# Altium project Carte_Micro_PIC18F.PrjPcb
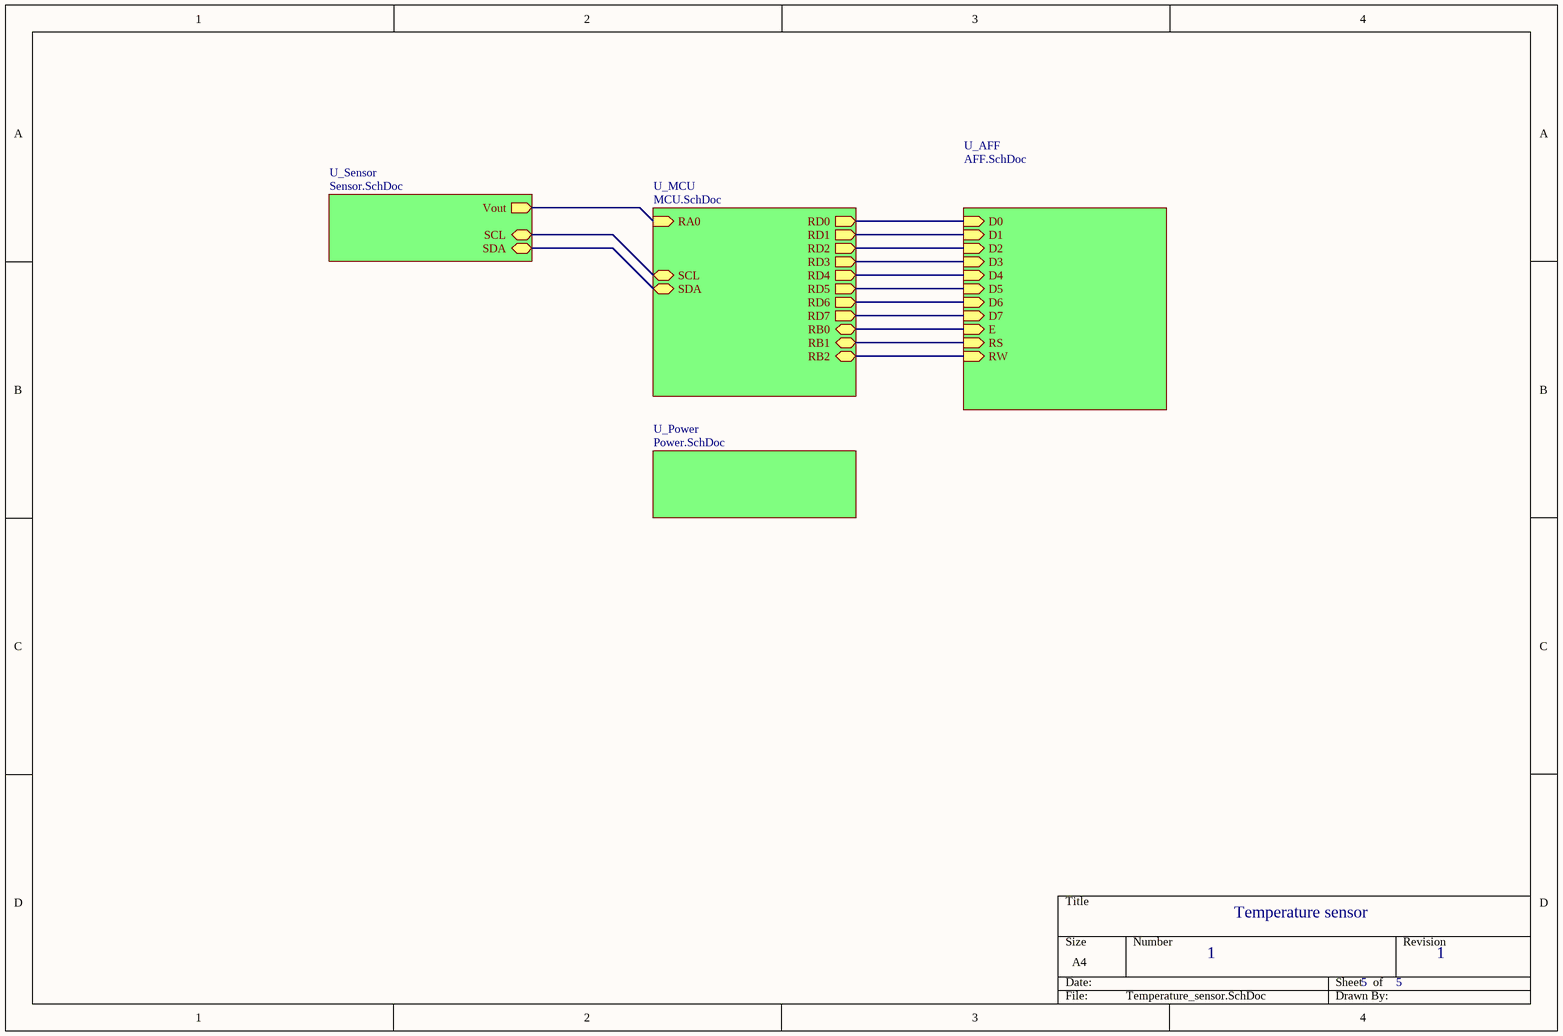
[diagram p0: Temperature_sensor.SchDoc]
5 sheets, 22 parts. Net scope: hierarchical (ports join the sheet entries above them; power ports are global).
Board file: Carte_Micro_PIC18F.PcbDoc
Sheets:
  Temperature_sensor.SchDoc
    U_Power = Power.SchDoc
    U_Sensor = Sensor.SchDoc
    U_MCU = MCU.SchDoc
    U_AFF = AFF.SchDoc

## Sheet Temperature_sensor.SchDoc: Temperature_sensor
size A4; DocumentNumber: 1; Revision: 1; SheetNumber: 1; SheetTotal: 5

### Sub-sheets
U_AFF = AFF.SchDoc: RS (in), RW (in), E (in), D0 (in), D1 (in), D2 (in), D3 (in), D4 (in), D5 (in), D6 (in), D7 (in)
U_MCU = MCU.SchDoc: RA0 (in), RB0 (bidir), RB1 (bidir), RB2 (bidir), SCL (bidir), SDA (bidir), RD0 (out), RD1 (out), RD2 (out), RD3 (out), RD4 (out), RD5 (out), RD6 (out), RD7 (out)
U_Power = Power.SchDoc: no entries
U_Sensor = Sensor.SchDoc: Vout (out), SDA (bidir), SCL (bidir)

### Nets
RA0: sheet U_Sensor/Vout, sheet U_MCU/RA0
RB0: sheet U_MCU/RB0, sheet U_AFF/E
RB1: sheet U_MCU/RB1, sheet U_AFF/RS
RB2: sheet U_MCU/RB2, sheet U_AFF/RW
RD0: sheet U_MCU/RD0, sheet U_AFF/D0
RD1: sheet U_MCU/RD1, sheet U_AFF/D1
RD2: sheet U_MCU/RD2, sheet U_AFF/D2
RD3: sheet U_MCU/RD3, sheet U_AFF/D3
RD4: sheet U_MCU/RD4, sheet U_AFF/D4
RD5: sheet U_MCU/RD5, sheet U_AFF/D5
RD6: sheet U_MCU/RD6, sheet U_AFF/D6
RD7: sheet U_MCU/RD7, sheet U_AFF/D7
SCL: sheet U_Sensor/SCL, sheet U_MCU/SCL
SDA: sheet U_Sensor/SDA, sheet U_MCU/SDA

### Notes on the sheet
- Temperature sensor
- 1
- 5

## Sheet Power.SchDoc: Power
size A4; DocumentNumber: 2; Revision: 1; SheetNumber: 4; SheetTotal: 5; SPICEModelCacheMWSFBRXI: <root> / <DocumentId>MWSFBRXI</DocumentId> / <CacheFrame Number="0"> / <Model Name="1n4001" Kind="MDL"> / <Text>*1N4001 MCE 8-16-95 / *50V 1A Si GenPurpose Diode pkg:DIODE0.4 1,2 / .MODEL 1N4001 D(IS=2.55E-9 RS=0.042 N=1.75 TT=5.76E-6 CJO=1.85E-11 / + VJ=0.75 M=0.333 BV=50 IBV=1E-5 )</Text> / </Model> / <Model Name="led0" Kind="MDL"> / <Text>*Typ INFRARED GaAs LED: Vf=1.2V Vr=5V If=40mA trr=3uS / *LED Pinout: 1=A, 2=K / .MODEL LED0 D (IS=93.5P RS=84M N=2.63 BV=5 IBV=10U / + CJO=2.97P VJ=.75 M=.333 TT=4.32U)</Text> / </Model> / <Model Name="cap" Kind="MDL"> / <Text>*Default semiconductor capacitor / .MODEL CAP C()</Text> / </Model> / </CacheFrame> / </root>
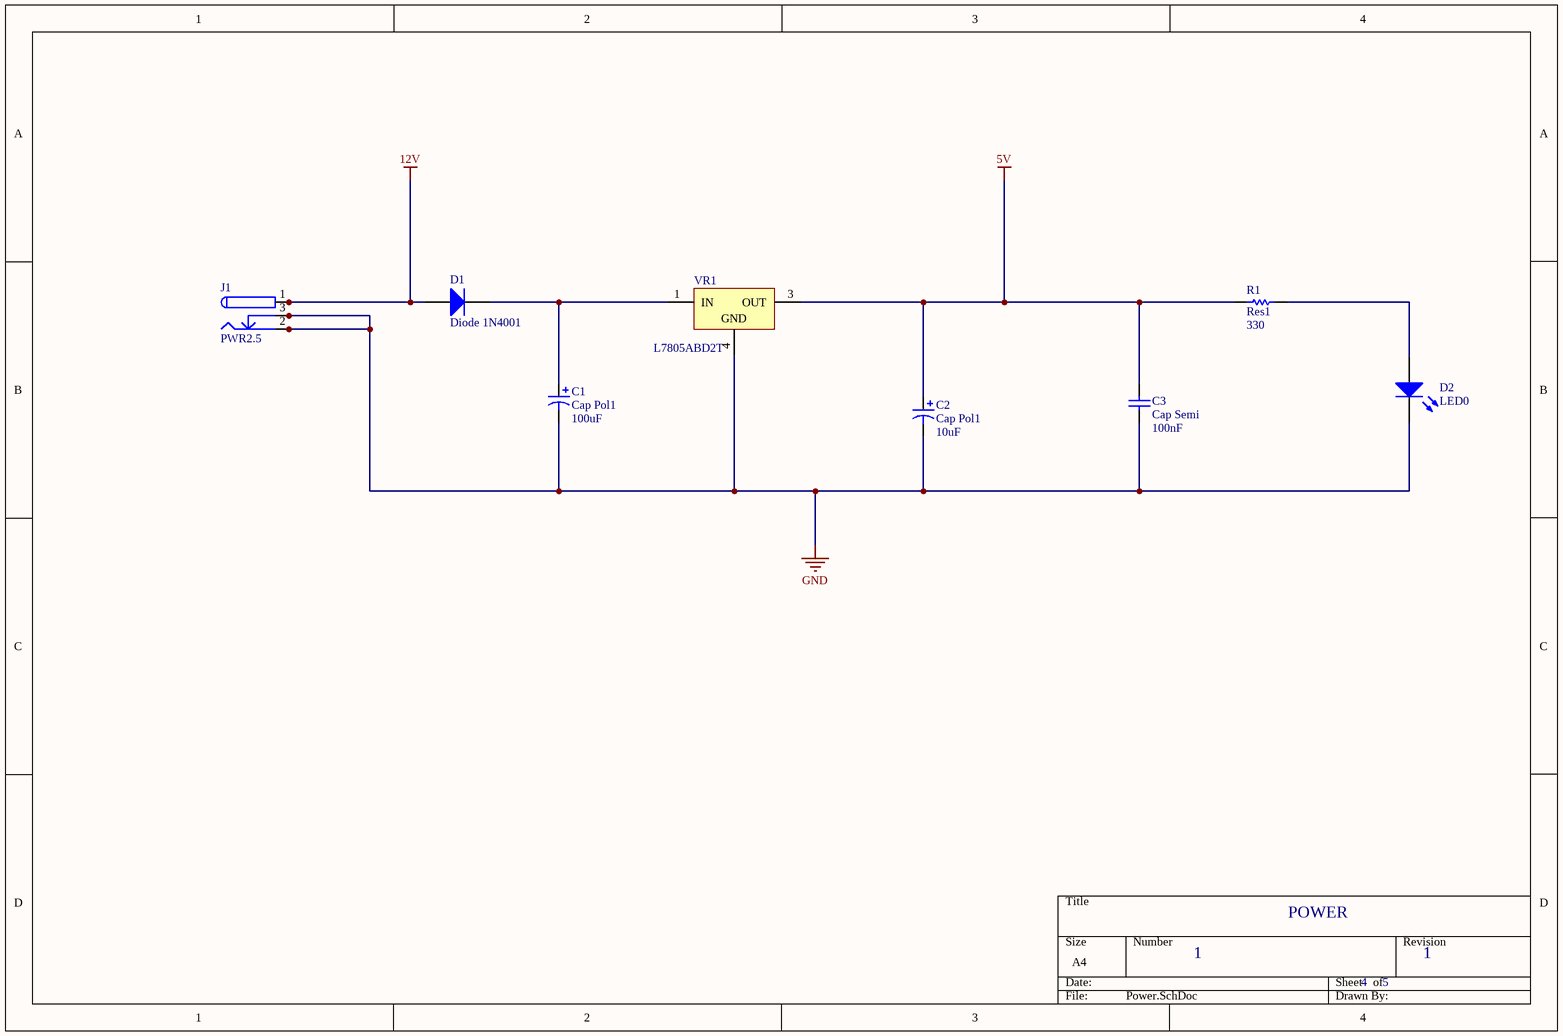
[diagram p1: Power.SchDoc]

### Parts
C1  Cap Pol1  value 100uF  [RB7.6-15]
C2  Cap Pol1  value 10uF  [RB7.6-15]
C3  Cap Semi  value 100nF  [C1206]
D1  Diode 1N4001  [DO-41]
D2  LED0  [LED-0]
J1  PWR2.5  [KLD-0202]
R1  Res1  value 330  [0805]
VR1  L7805ABD2T  [TO-263]

### Nets
5V: C2.1 C3.2 R1.1 VR1.3(OUT)
12V: D1.1(A) J1.1 J1.1A J1.1B
GND: C1.2 C2.2 C3.1 D2.2(K) J1.2 J1.2A J1.2B J1.3 J1.3A J1.3B VR1.4(GND)
NetC1_1: C1.1 D1.2(K) VR1.1(IN)
NetD2_1: D2.1(A) R1.2

### Notes on the sheet
- POWER
- 1
- 4
- 5

### Library data of the parts
C1 C2 = Cap Pol1: Polarized Capacitor (Radial); Published: 8-Jun-2000; LatestRevisionDate: 17-Jul-2002; LatestRevisionNote: Re-released for DXP Platform.; PackageReference: RB7.6-15; Publisher: Altium Limited; PackageDescription: Polarized Capacitor (Radial); 2 Leads
C3 = Cap Semi: Capacitor (Semiconductor SIM Model); Published: 8-Jun-2000; LatestRevisionDate: 29-May-2009; LatestRevisionNote: IPC-7351 Footprint Added.; PackageReference: C1206; Publisher: Altium Limited; PackageDescription: Chip Capacitor
D1 = Diode 1N4001: 1 Amp General Purpose Rectifier; Published: 8-Jun-2000; LatestRevisionDate: 17-Jul-2002; LatestRevisionNote: Re-released for DXP Platform.; DatasheetVersion: 1998; PackageVersion: Aug-1999; PackageReference: DO-41; Publisher: Altium Limited; PackageDescription: Diode, Axial; Body 5.2 x 2.7 mm (LxDia. max), Lead Dia. 0.86 mm (max); Code_JEDEC: DO-204-AL; ComponentLink1Description: Manufacturer Link; ComponentLink1URL: http://www.fairchildsemi.com/; ComponentLink2Description: Datasheet; ComponentLink2URL: http://www.fairchildsemi.com/ds/1N%2F1N4001.pdf
D2 = LED0: Typical INFRARED GaAs LED; Published: 8-Jun-2000; LatestRevisionDate: 08-Jul-2005; LatestRevisionNote: Mech Layer 1 removed.; PackageReference: LED-0; Publisher: Altium Limited; PackageDescription: LED; 2 Leads
J1 = PWR2.5: Low Voltage Power Supply Connector; Published: 17-Dec-2003; DatasheetDocument: 09-May-2002; Publisher: Altium Limited; ComponentLink1Description: Manufacturer Link; ComponentLink1URL: http://domino.kycon.com/internet/Products.html
R1 = Res1: Resistor; Published: 8-Jun-2000; LatestRevisionDate: 17-Jul-2002; LatestRevisionNote: Re-released for DXP Platform.; PackageReference: AXIAL-0.3; Publisher: Altium Limited; PackageDescription: Axial Device, Thru-Hole; 2 Leads; 0.3 in Pin Spacing
VR1 = L7805ABD2T: Precision 1A Regulator; Published: 24-Aug-2001; LatestRevisionDate: 17-Jul-2002; LatestRevisionNote: Re-released for DXP Platform.; DatasheetVersion: Nov-1999; PackageReference: TO-263; Publisher: Altium Limited; PackageDescription: D2-PAK/TO-263-AB; 3 Leads (1 Cropped); Body 15.9 (inc. leads) x 10.4 mm (LxW max); ComponentLink1Description: Manufacturer Link; ComponentLink1URL: http://www.st.com/; ComponentLink2Description: Datasheet; ComponentLink2URL: http://www.st.com/stonline/products/literature/ds/2144/l7805ab.pdf

## Sheet Sensor.SchDoc: Sensor
size A4; DocumentNumber: 1; Revision: 1; SheetNumber: 3; SheetTotal: 5
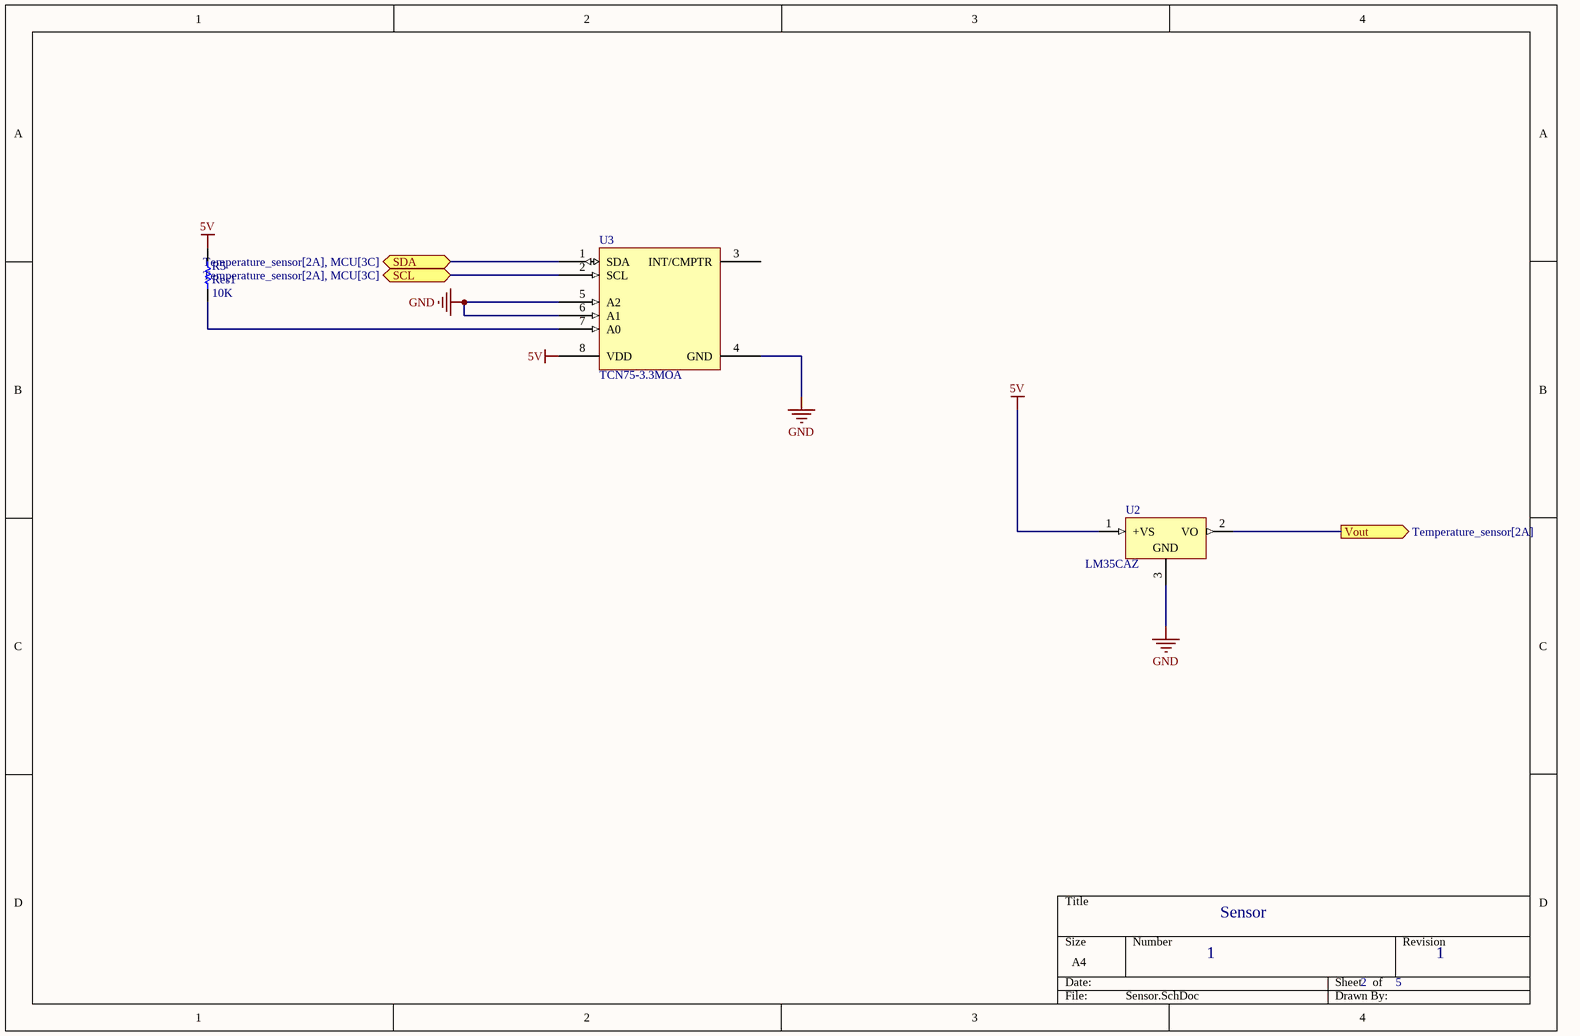
[diagram p2: Sensor.SchDoc]

### Parts
R5  Res1  value 10K  [0805]
U2  LM35CAZ  [Z03A]
U3  TCN75-3.3MOA  [SOIC127P600X175-8N]

### Ports
SCL (bidir, see Temperature_sensor[2A], MCU[3C]), SDA (bidir, see Temperature_sensor[2A], MCU[3C]), Vout (out, see Temperature_sensor[2A])

### Nets
5V: R5.2 U2.1(+VS) U3.8(VDD)
GND: U2.3(GND) U3.4(GND) U3.5(A2) U3.6(A1)
RA0: U2.2(VO) ; port Vout
SCL: U3.2(SCL) ; port SCL
SDA: U3.1(SDA) ; port SDA
NetR5_1: R5.1 U3.7(A0)

Not connected (* = marked no-connect by the designer): U3 3(INT/CMPTR)

### Notes on the sheet
- Sensor
- 1
- 2
- 5

### Library data of the parts
R5 = Res1: Resistor; Published: 8-Jun-2000; LatestRevisionDate: 17-Jul-2002; LatestRevisionNote: Re-released for DXP Platform.; PackageReference: AXIAL-0.3; Publisher: Altium Limited; PackageDescription: Axial Device, Thru-Hole; 2 Leads; 0.3 in Pin Spacing
U2 = LM35CAZ: Precision Centigrade Temperature Sensor, 3-pin TO-92; Manufacturer: National Semiconductor; PackageTopMarking: NSXYTT*LM35*CAZ; PowerWise: N; CompType: Temp Sensor IC; Published: 4-Dec-2008; LatestRevisionDate: 15-Jul-2009; LatestRevisionNote: Sch pins 1 & 3 reversed.; DatasheetVersion: Nov-2000; PackageVersion: revG, Sep-2000; PackageReference: Z03A; Publisher: Altium Limited; PackageDescription: TO-92, Molded, 3 Lead; Supplier 1: Farnell; Supplier Part Number 1: 9494529; PartNumber: LM35CAZ; RoHS: N; PinCount: 3; Code_JEDEC: TO-226-AA; ComponentLink1Description: LM35 Datasheet; ComponentLink1URL: http://www.national.com/ds/LM/LM35.pdf; ComponentLink2Description: LM35 Web Page; ComponentLink2URL: http://www.national.com/pf/LM/LM35.html; ComponentLink3Description: Z03A Package Page; ComponentLink3URL: http://www.national.com/packaging/folders/z03a.html
U3 = TCN75

## Sheet MCU.SchDoc: MCU
size A4; DocumentNumber: 1; Revision: 1; SheetNumber: 2; SheetTotal: 5; SPICEModelCacheJNIDMDJG: <root> / <DocumentId>JNIDMDJG</DocumentId> / <CacheFrame Number="0"> / <Model Name="xtal" Kind="CKT"> / <Text>*Generic type:crystal pkg:HC33/51 / .SUBCKT XTAL 1 2 PARAMS: FREQ=1Meg RS=750 C=13pf Q=1000 / LX 1 3 {((Q*RS)/(6.2831852*FREQ))} IC=0.5M / CX 3 4 {(1/(Q*6.2831852*FREQ*RS))} / C0 1 2 {C} / RS 4 2 {RS} / .ENDS XTAL</Text> / </Model> / <Model Name="cap" Kind="MDL"> / <Text>*Default semiconductor capacitor / .MODEL CAP C()</Text> / </Model> / </CacheFrame> / </root>
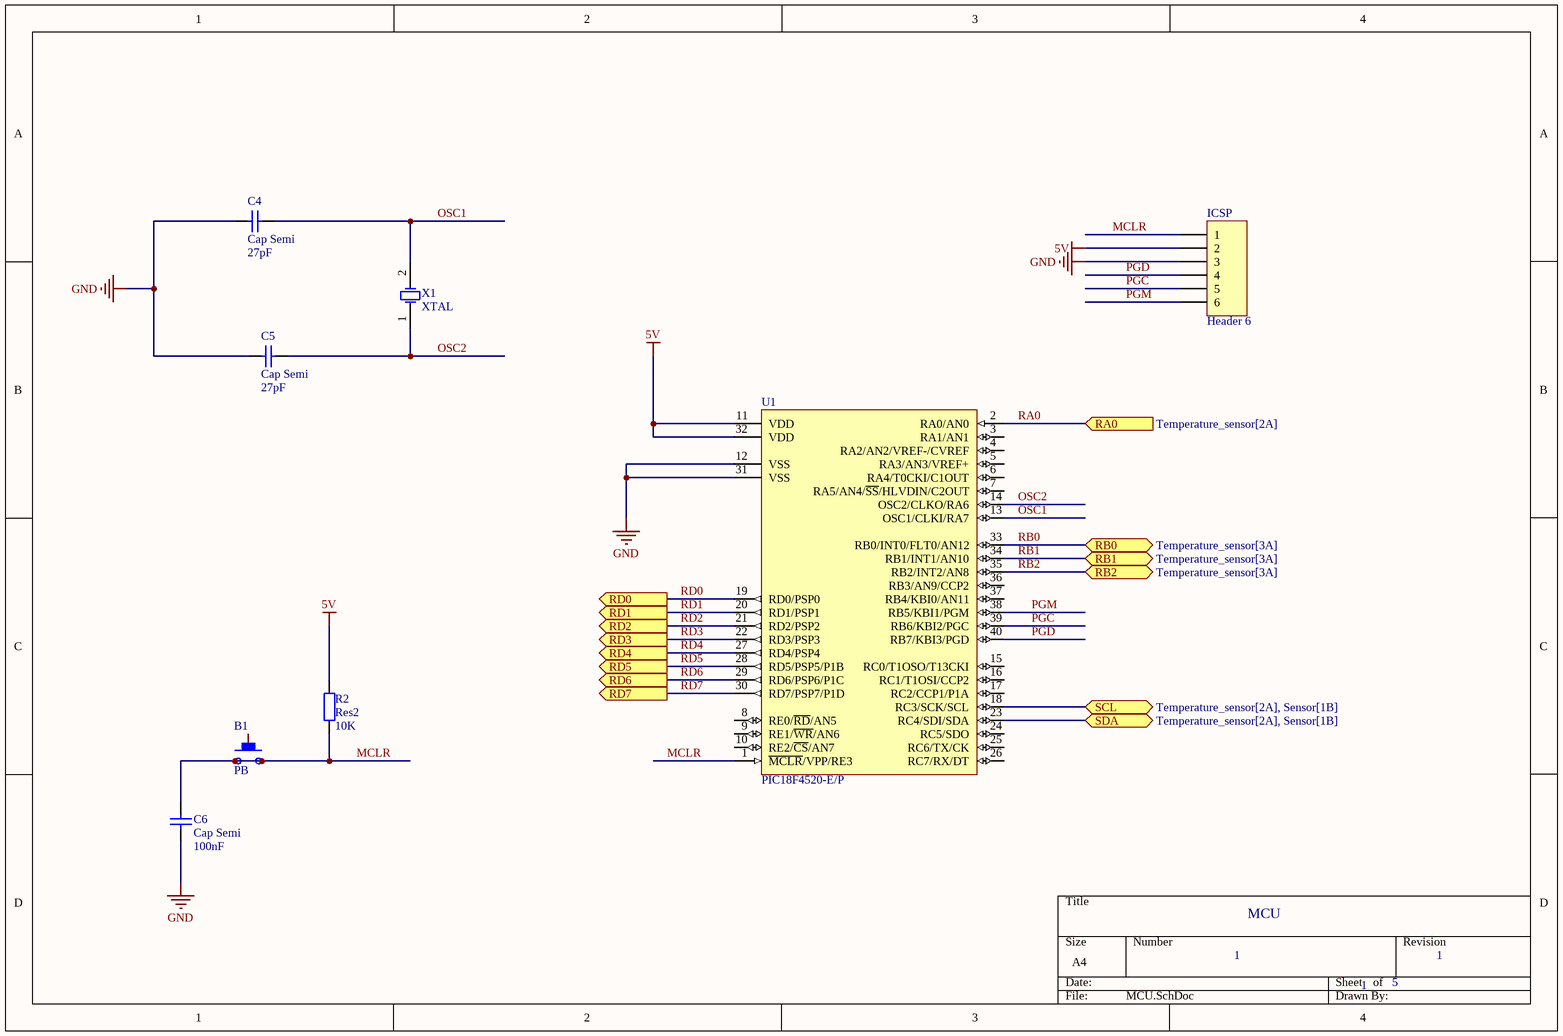
[diagram p3: MCU.SchDoc]

### Parts
B1  PB  [Push button]
C4  Cap Semi  value 27pF  [C1206]
C5  Cap Semi  value 27pF  [C1206]
C6  Cap Semi  value 100nF  [C1206]
ICSP  Header 6  [HDR1X6]
R2  Res2  value 10K  [0805]
U1  PIC18F4520-E/P  [PDIP600-P40]
X1  XTAL  [R38]

### Ports
RA0 (in, see Temperature_sensor[2A]), RB0 (bidir, see Temperature_sensor[3A]), RB1 (bidir, see Temperature_sensor[3A]), RB2 (bidir, see Temperature_sensor[3A]), RD0 (out), RD1 (out), RD2 (out), RD3 (out), RD4 (out), RD5 (out), RD6 (out), RD7 (out), SCL (bidir, see Temperature_sensor[2A], Sensor[1B]), SDA (bidir, see Temperature_sensor[2A], Sensor[1B])

### Nets
5V: ICSP.2 R2.2 U1.11(VDD) U1.32(VDD)
GND: C4.1 C5.1 C6.2 ICSP.3 U1.12(VSS) U1.31(VSS)
MCLR: B1.0 B1.1 C6.1 ICSP.1 R2.1 U1.1(~{MCLR}/VPP/RE3)
OSC1: C4.2 U1.13(OSC1/CLKI/RA7) X1.2(OSC2)
OSC2: C5.2 U1.14(OSC2/CLKO/RA6) X1.1(OSC1)
PGC: ICSP.5 U1.39(RB6/KBI2/PGC)
PGD: ICSP.4 U1.40(RB7/KBI3/PGD)
PGM: ICSP.6 U1.38(RB5/KBI1/PGM)
RA0: U1.2(RA0/AN0) ; port RA0
RB0: U1.33(RB0/INT0/FLT0/AN12) ; port RB0
RB1: U1.34(RB1/INT1/AN10) ; port RB1
RB2: U1.35(RB2/INT2/AN8) ; port RB2
RD0: U1.19(RD0/PSP0) ; port RD0
RD1: U1.20(RD1/PSP1) ; port RD1
RD2: U1.21(RD2/PSP2) ; port RD2
RD3: U1.22(RD3/PSP3) ; port RD3
RD4: U1.27(RD4/PSP4) ; port RD4
RD5: U1.28(RD5/PSP5/P1B) ; port RD5
RD6: U1.29(RD6/PSP6/P1C) ; port RD6
RD7: U1.30(RD7/PSP7/P1D) ; port RD7
SCL: U1.18(RC3/SCK/SCL) ; port SCL
SDA: U1.23(RC4/SDI/SDA) ; port SDA

Not connected (* = marked no-connect by the designer): U1 3(RA1/AN1) 4(RA2/AN2/VREF-/CVREF) 5(RA3/AN3/VREF+) 6(RA4/T0CKI/C1OUT) 7(RA5/AN4/~{SS}/HLVDIN/C2OUT) 8(RE0/~{RD}/AN5) 9(RE1/~{WR}/AN6) 10(RE2/~{CS}/AN7) 15(RC0/T1OSO/T13CKI) 16(RC1/T1OSI/CCP2) 17(RC2/CCP1/P1A) 24(RC5/SDO) 25(RC6/TX/CK) 26(RC7/RX/DT) 36(RB3/AN9/CCP2) 37(RB4/KBI0/AN11)

### Notes on the sheet
- MCU
- 1
- 5

### Library data of the parts
C4-C6 = Cap Semi: Capacitor (Semiconductor SIM Model); Published: 8-Jun-2000; LatestRevisionDate: 29-May-2009; LatestRevisionNote: IPC-7351 Footprint Added.; PackageReference: C1206; Publisher: Altium Limited; PackageDescription: Chip Capacitor
ICSP = Header 6: Header, 6-Pin; LatestRevisionDate: 17-Jul-2002; LatestRevisionNote: Re-released for DXP Platform.; Publisher: Altium Limited
R2 = Res2: Resistor; Published: 8-Jun-2000; LatestRevisionDate: 17-Jul-2002; LatestRevisionNote: Re-released for DXP Platform.; PackageReference: AXIAL-0.4; Publisher: Altium Limited; PackageDescription: Axial Device, Thru-Hole; 2 Leads; 0.4 in Pin Spacing
U1 = PIC18F4520-E/P: Enhanced Flash Microcontroller with 10-Bit A/D and nanoWatt Technology, 32K Flash, 40-Pin PDIP, Extended Temperature Range; Published: 29-Jan-2009; LatestRevisionDate: 02-Dec-2009; LatestRevisionNote: Updated to datasheet revision E, Oct-2008; DatasheetVersion: revE, Oct-2008; PackageVersion: revBB, Aug-2009; PackageReference: PDIP600-P40; Publisher: Altium Limited; PackageDescription: 40-Lead Plastic Dual In-Line (P) - 600 mil Body [PDIP]; Supplier 1: Digi-Key; Supplier Part Number 1: PIC18F4520-E/P-ND; ComponentLink1Description: Datasheet; ComponentLink1URL: http://ww1.microchip.com/downloads/en/DeviceDoc/39631E.pdf; ComponentLink2Description: Packaging Specification; ComponentLink2URL: http://www.microchip.com/stellent/groups/techpub_sg/documents/packagingspec/en012702.pdf; ComponentLink3Description: Microchip.com Home; ComponentLink3URL: http://www.microchip.com/
X1 = XTAL: Crystal Oscillator; Published: 8-Jun-2000; LatestRevisionDate: 17-Jul-2002; LatestRevisionNote: Re-released for DXP Platform.; PackageReference: R38; Publisher: Altium Limited; PackageDescription: Crystal, Thru-Hole; 2 Leads; Body 3.1 x 8.2 mm (Dia.xH)

## Sheet AFF.SchDoc: Afficheur LCD 16X2
size A4; DocumentNumber: 1; Revision: 1; SheetNumber: 2; SheetTotal: 5; SPICEModelCacheVBWOYBCN: <root> / <DocumentId>VBWOYBCN</DocumentId> / <CacheFrame Number="0"> / <Model Name="res" Kind="MDL"> / <Text>*Default semiconductor resistor / .MODEL RES R()</Text> / </Model> / </CacheFrame> / </root>
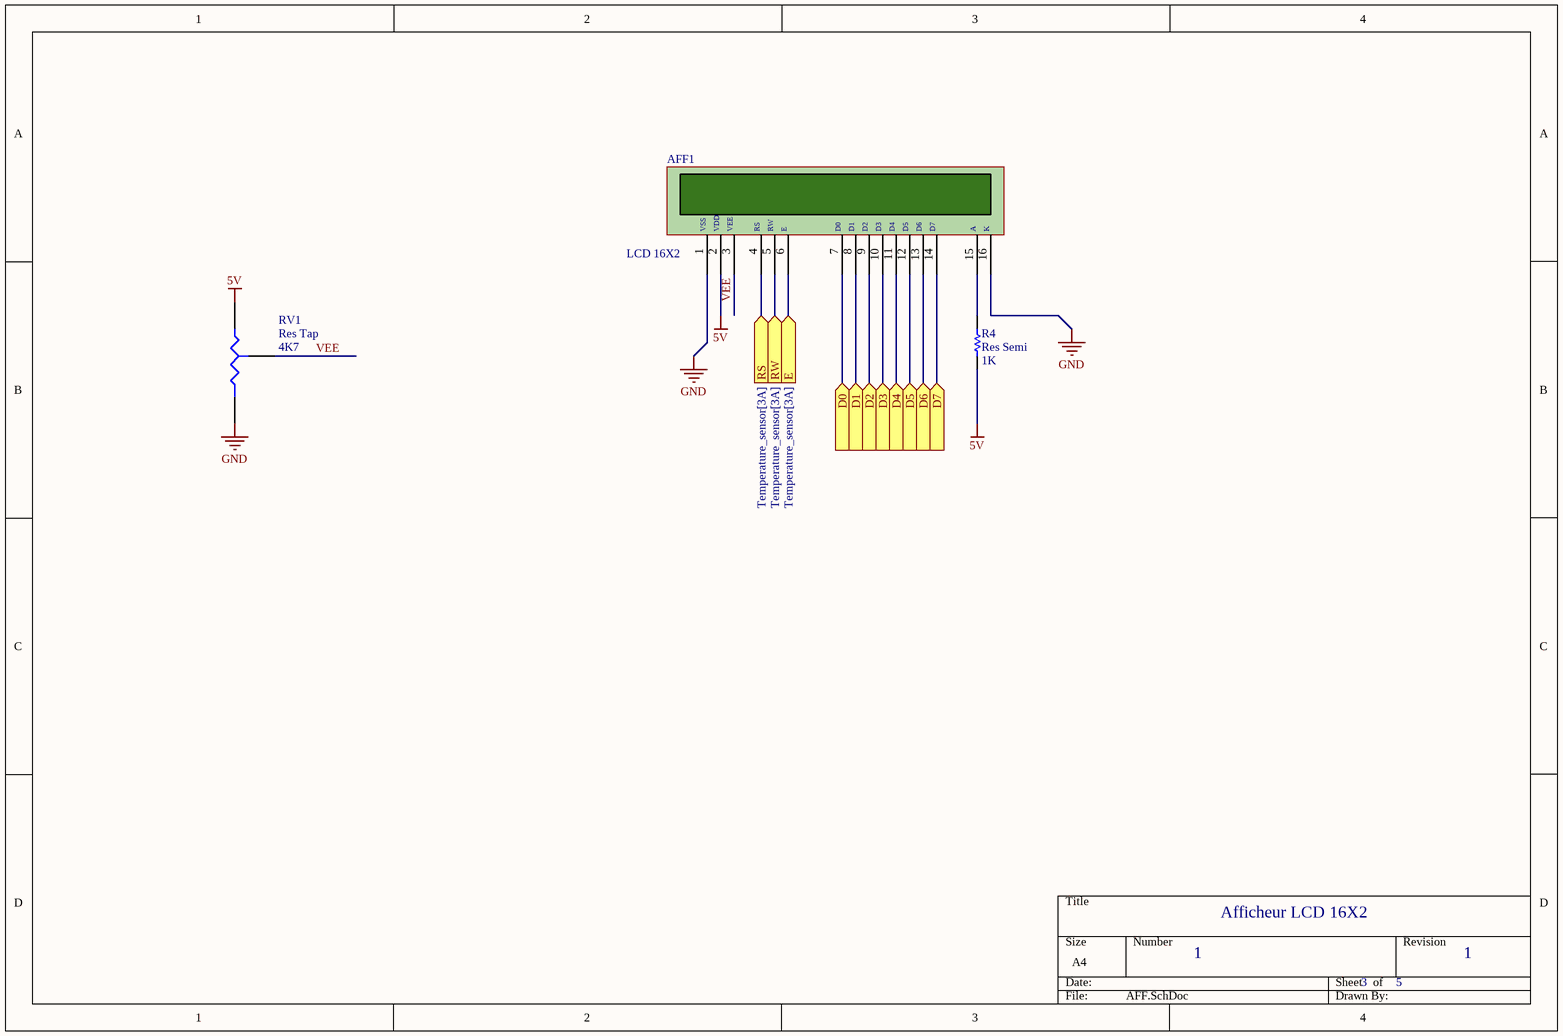
[diagram p4: AFF.SchDoc]

### Parts
AFF1  LCD 16X2  [lcd 16x2]
R4  Res Semi  value 1K  [0805]
RV1  Res Tap  value 4K7  [VR3]

### Ports
D0 (in), D1 (in), D2 (in), D3 (in), D4 (in), D5 (in), D6 (in), D7 (in), E (in, see Temperature_sensor[3A]), RS (in, see Temperature_sensor[3A]), RW (in, see Temperature_sensor[3A])

### Nets
5V: AFF1.2 R4.1 RV1.1(A)
GND: AFF1.1 AFF1.16 RV1.2(B)
RB0: AFF1.6 ; port E
RB1: AFF1.4 ; port RS
RB2: AFF1.5 ; port RW
RD0: AFF1.7 ; port D0
RD1: AFF1.8 ; port D1
RD2: AFF1.9 ; port D2
RD3: AFF1.10 ; port D3
RD4: AFF1.11 ; port D4
RD5: AFF1.12 ; port D5
RD6: AFF1.13 ; port D6
RD7: AFF1.14 ; port D7
VEE: AFF1.3 RV1.3(TAP)
NetAFF1_15: AFF1.15 R4.2

### Notes on the sheet
- Afficheur LCD 16X2
- 1
- 3
- 5
- (in symbol AFF) VSS; VDD; VEE; RS; RW; E; D0; D1; D2; D3; D4; D5; D6; D7; A; K

### Library data of the parts
AFF1 = AFF
R4 = Res Semi: Semiconductor Resistor; Published: 8-Jun-2000; LatestRevisionDate: 17-Jul-2002; LatestRevisionNote: Re-released for DXP Platform.; PackageReference: AXIAL-0.5; Publisher: Altium Limited; PackageDescription: Axial Device, Thru-Hole; 2 Leads; 0.5 in Pin Spacing
RV1 = Res Tap: Tapped Resistor; Sim Note: Enter the Resistance value and the set point into parameter fields.; Set Position: 0.5; Published: 24-Mar-1999; LatestRevisionDate: 17-Jul-2002; LatestRevisionNote: Re-released for DXP Platform.; PackageReference: VR3; Publisher: Altium Limited; PackageDescription: Variable Resistor, Thru-Hole; 3 Leads

## Nets that join several sheets
5V: Power (C2.1 C3.2 R1.1 VR1.3), Sensor (R5.2 U2.1 U3.8), MCU (ICSP.2 R2.2 U1.11 U1.32), AFF (AFF1.2 R4.1 RV1.1)
GND: Power (11 pins), Sensor (U2.3 U3.4 U3.5 U3.6), MCU (6 pins), AFF (AFF1.1 AFF1.16 RV1.2)
RA0: Sensor (U2.2), MCU (U1.2)
RB0: MCU (U1.33), AFF (AFF1.6)
RB1: MCU (U1.34), AFF (AFF1.4)
RB2: MCU (U1.35), AFF (AFF1.5)
RD0: MCU (U1.19), AFF (AFF1.7)
RD1: MCU (U1.20), AFF (AFF1.8)
RD2: MCU (U1.21), AFF (AFF1.9)
RD3: MCU (U1.22), AFF (AFF1.10)
RD4: MCU (U1.27), AFF (AFF1.11)
RD5: MCU (U1.28), AFF (AFF1.12)
RD6: MCU (U1.29), AFF (AFF1.13)
RD7: MCU (U1.30), AFF (AFF1.14)
SCL: Sensor (U3.2), MCU (U1.18)
SDA: Sensor (U3.1), MCU (U1.23)